# Altium schematic sheet FPGA Power.SchDoc
size A4
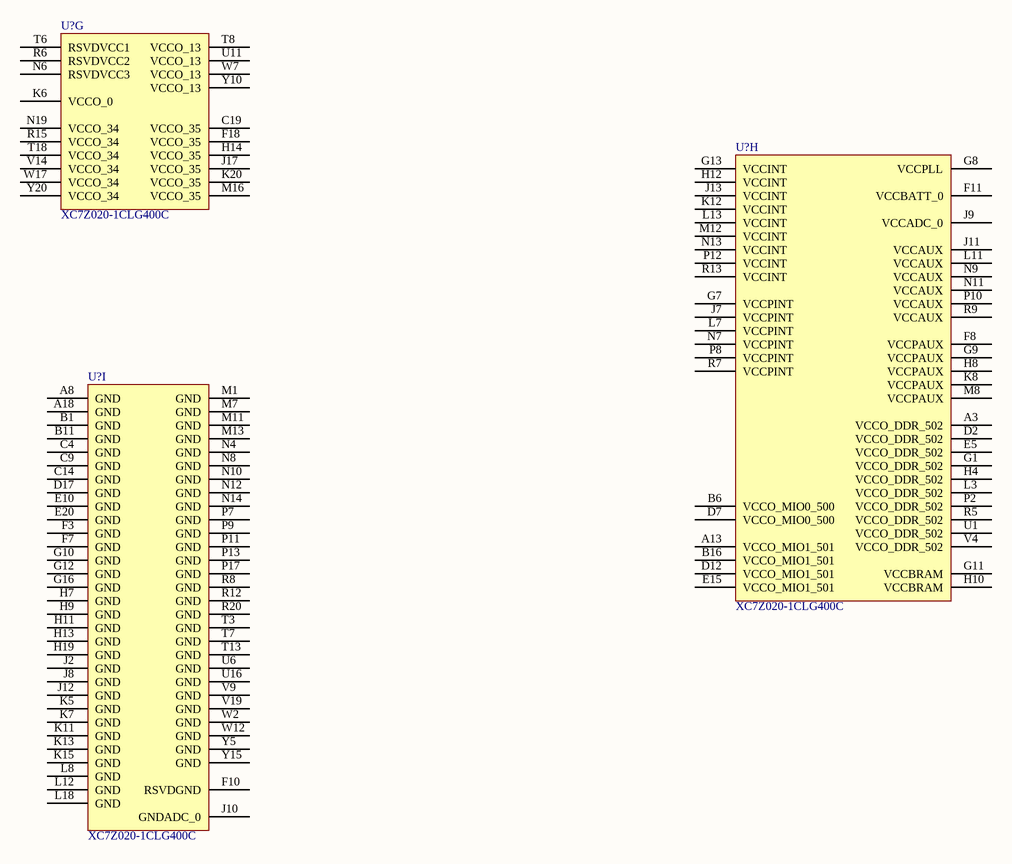
[diagram p0: FPGA Power.SchDoc]

## Parts
(Parts that share a designator on the sheet are numbered #1, #2 ... from top to bottom, then left to right.)
U?#1  XC7Z020-1CLG400C  [CLG400]  (part G of 9)
U?#2  XC7Z020-1CLG400C  [CLG400]  (part H of 9)
U?#3  XC7Z020-1CLG400C  [CLG400]  (part I of 9)

## Nets

Not connected (* = marked no-connect by the designer): U?#1 C19(VCCO_35) F18(VCCO_35) H14(VCCO_35) J17(VCCO_35) K6(VCCO_0) K20(VCCO_35) M16(VCCO_35) N6(RSVDVCC3) N19(VCCO_34) R6(RSVDVCC2) R15(VCCO_34) T6(RSVDVCC1) T8(VCCO_13) T18(VCCO_34) U11(VCCO_13) V14(VCCO_34) W7(VCCO_13) W17(VCCO_34) Y10(VCCO_13) Y20(VCCO_34); U?#2 A3(VCCO_DDR_502) A13(VCCO_MIO1_501) B6(VCCO_MIO0_500) B16(VCCO_MIO1_501) D2(VCCO_DDR_502) D7(VCCO_MIO0_500) D12(VCCO_MIO1_501) E5(VCCO_DDR_502) E15(VCCO_MIO1_501) F8(VCCPAUX) F11(VCCBATT_0) G1(VCCO_DDR_502) G7(VCCPINT) G8(VCCPLL) G9(VCCPAUX) G11(VCCBRAM) G13(VCCINT) H4(VCCO_DDR_502) H8(VCCPAUX) H10(VCCBRAM) H12(VCCINT) J7(VCCPINT) J9(VCCADC_0) J11(VCCAUX) J13(VCCINT) K8(VCCPAUX) K12(VCCINT) L3(VCCO_DDR_502) L7(VCCPINT) L11(VCCAUX) L13(VCCINT) M8(VCCPAUX) M12(VCCINT) N7(VCCPINT) N9(VCCAUX) N11(VCCAUX) N13(VCCINT) P2(VCCO_DDR_502) P8(VCCPINT) P10(VCCAUX) P12(VCCINT) R5(VCCO_DDR_502) R7(VCCPINT) R9(VCCAUX) R13(VCCINT) U1(VCCO_DDR_502) V4(VCCO_DDR_502); U?#3 A8(GND) A18(GND) B1(GND) B11(GND) C4(GND) C9(GND) C14(GND) D17(GND) E10(GND) E20(GND) F3(GND) F7(GND) F10(RSVDGND) G10(GND) G12(GND) G16(GND) H7(GND) H9(GND) H11(GND) H13(GND) H19(GND) J2(GND) J8(GND) J10(GNDADC_0) J12(GND) K5(GND) K7(GND) K11(GND) K13(GND) K15(GND) L8(GND) L12(GND) L18(GND) M1(GND) M7(GND) M11(GND) M13(GND) N4(GND) N8(GND) N10(GND) N12(GND) N14(GND) P7(GND) P9(GND) P11(GND) P13(GND) P17(GND) R8(GND) R12(GND) R20(GND) T3(GND) T7(GND) T13(GND) U6(GND) U16(GND) V9(GND) V19(GND) W2(GND) W12(GND) Y5(GND) Y15(GND)

## Notes on the sheet
- Title
- Size:
- Date:
- A3
- Drawn by:
- Time:
- Revision:
- Sheet
- of
- File:

## Library data of the parts
U?#1-U?#3 = CMP-0363-00002-3: SoC - 667 MHz Zynq™-7000 AP SoC, 130 PS I/O, 125 FPGA I/O, 400-Ball BGA, Speed Grade 1, Commercial Grade, Pb-Free; Flip Flops: 106400; Speed Grade: -1; LUTs: 53200; Extensible Block RAM (# 36Kb Blocks): 560 KB (140); PackageVersion: Rev 1.1, 09/2012; ComponentLink1Description: Datasheet; ComponentLink2Description: Package Specification; ComponentLink6Description: PCB and Layout Guide; PackageDescription: Wire-Bond Chip-Scale BGA, Body 17 x 17 mm, 0.8 mm Pitch; RoHS: Pb-Free; DatasheetVersion: v1.2; Mounting Technology: Surface Mount; ComponentLink5Description: Packaging and Pinout; ComponentLink5URL: http://www.xilinx.com/support/documentation/user_guides/ug865-Zynq-7000-Pkg-Pinout.pdf; ComponentLink6URL: http://www.xilinx.com/support/documentation/user_guides/ug483_7Series_PCB.pdf; Generic Part Number: XC7Z020; ComponentLink3Description: DC and AC Switching Characteristics; ComponentLink2URL: http://www.xilinx.com/support/documentation/user_guides/ug865-Zynq-7000-Pkg-Pinout.pdf; ComponentLink4Description: Package File; ComponentLink1URL: http://www.xilinx.com/support/documentation/data_sheets/ds190-Zynq-7000-Overview.pdf; PackageReference: CLG400; ComponentLink3URL: http://www.xilinx.com/support/documentation/data_sheets/ds187-XC7Z010-XC7Z020-Data-Sheet.pdf; PartNumber: XC7Z020-1CLG400C; ComponentLink4URL: http://www.xilinx.com/support/packagefiles/z7packages/xc7z020clg400pkg.txt; Code_JEDEC: MO-275-MMAA-1